# EAGLE schematic beacon3v04 (EAGLE 6.1)
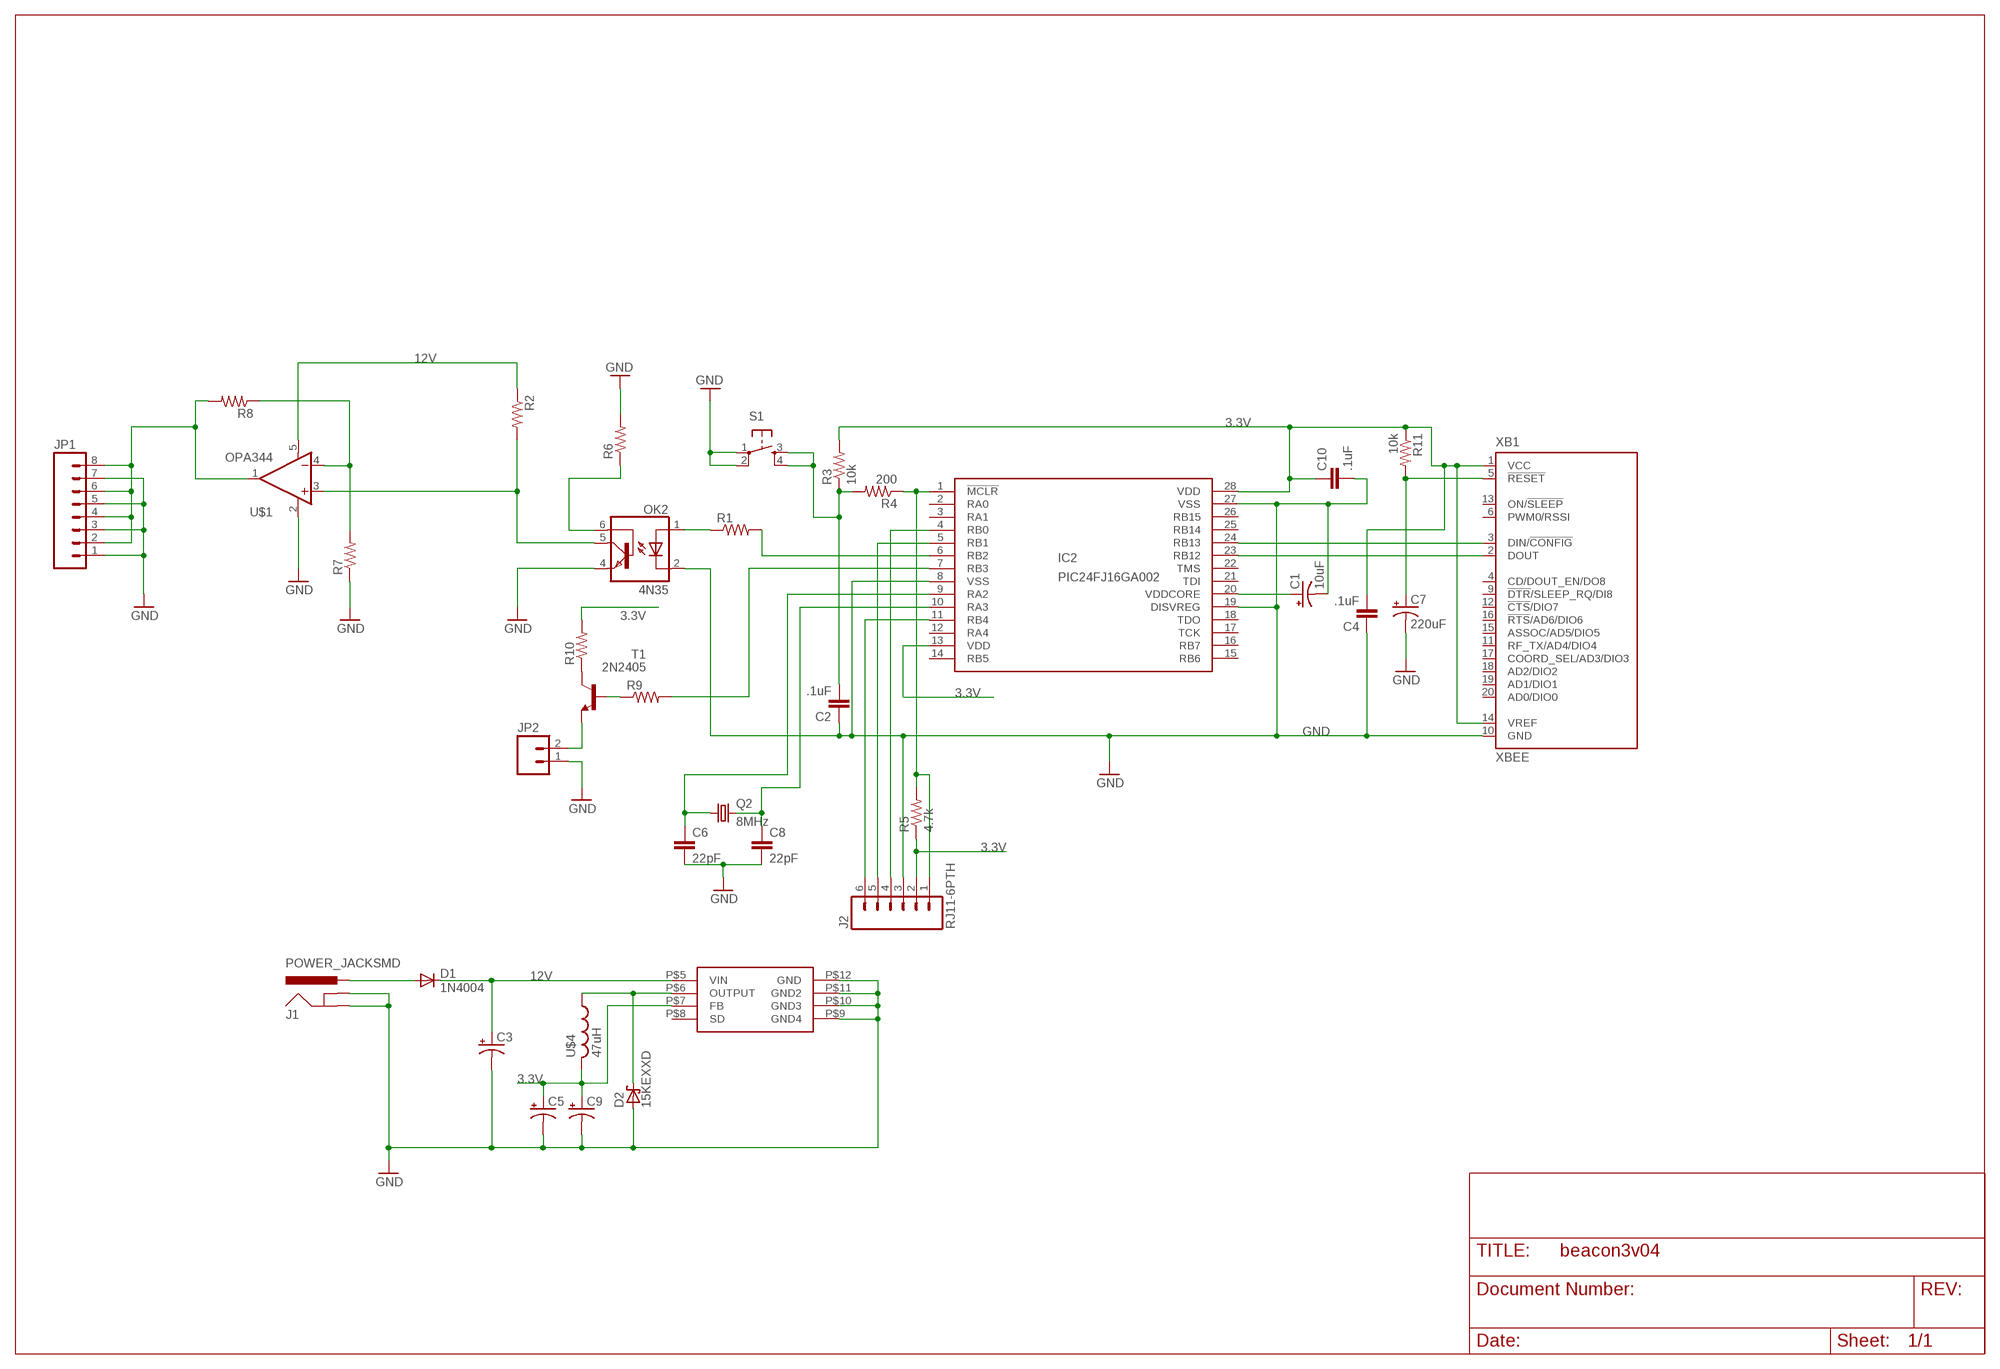
[diagram p0: schematic, sheet 1]

## Parts
C1  10uF  CAP_POL1206  [EIA3216]
C2  .1uF  C-EUC1206  [C1206]
C3  CAP_POL1206  [EIA3216]
C4  .1uF  C-EUC1206  [C1206]
C5  CAP_POL1206  [EIA3216]
C6  22pF  C-EUC1206  [C1206]
C7  220uF  CAP_POL1206  [EIA3216]
C8  22pF  C-EUC1206  [C1206]
C9  CAP_POL1206  [EIA3216]
C10  .1uF  C-EUC1206  [C1206]
D1  1N4004  [DO41-10]
D2  15KEXXD  [DO201T15]
IC2  PIC24FJ16GA002  [SO28W]
J1  POWER_JACKSMD  [POWER_JACK_SMD]
J2  RJ11-6PTH  [RJ11-6]
JP1  M08LOCK  [1X08_LOCK]
JP2  M02LOCK  [1X02_LOCK]
OK2  4N35  [DIL06]
Q2  8MHz  CRYSTALHC49UP  [HC49UP]
R1  RESISTOR1206  [1206]
R2  RESISTOR1206  [1206]
R3  10k  RESISTOR1206  [1206]
R4  200  RESISTOR1206  [1206]
R5  4.7k  R-US_R1206  [R1206]
R6  R-US_R1206  [R1206]
R7  RESISTOR1206  [1206]
R8  RESISTOR1206  [1206]
R9  R-US_R1206  [R1206]
R10  R-US_R1206  [R1206]
R11  10k  RESISTOR1206  [1206]
S1  TAC_SWITCHSMD  [TACTILE_SWITCH_SMD]
T1  2N2405  [TO5]
U$1  OPA344  [SOT23-5]
U$3  BUCK1  [BUCK]
U$4  47uH  BUCKINDUCTOR  [BUCKINDUCTOR2]
XB1  XBEE  [XBEE]

## Nets
3.3V: C4.2 C5.A(+) C9.A(+) C10.1 IC2.13(VDD) IC2.28(VDD) J2.2 R3.2 R5.1 R10.2 R11.1 U$3.P$7(FB) U$4.P$2 XB1.1(VCC) XB1.14(VREF)
12V: C3.A(+) D1.C R2.1 U$1.5(V+) U$3.P$5(VIN)
GND: C1.C(-) C2.1 C3.C(-) C4.1 C5.C(-) C6.2 C7.C(-) C8.2 C9.C(-) C10.2 D2.A IC2.8(VSS) IC2.19(DISVREG) IC2.27(VSS) J1.GND(GNDBREAK) J1.P$4(GND) J2.3 JP1.1 JP1.3 JP1.5 JP1.7 JP2.1 OK2.2(C) OK2.4(EMI) R6.2 R7.1 S1.1 S1.2 U$1.2(V-) U$3.P$9(GND4) U$3.P$10(GND3) U$3.P$11(GND2) U$3.P$12(GND) XB1.10(GND)
N$1: IC2.6(RB2) R1.2
N$2: OK2.1(A) R1.1
N$3: R7.2 R8.1 U$1.4(-IN)
N$4: D1.A J1.VIN0(PWR)
N$5: OK2.6(BAS) R6.1
N$6: IC2.23(RB12) XB1.2(DOUT)
N$7: JP1.2 JP1.4 JP1.6 JP1.8 R8.2 U$1.1(OUT)
N$8: IC2.24(RB13) XB1.3(DIN/!CONFIG)
N$9: IC2.4(RB0) J2.4
N$10: C1.A(+) IC2.20(VDDCORE)
N$11: C2.2 R3.1 R4.2 S1.3 S1.4
N$12: IC2.1(!MCLR) J2.1 R4.1 R5.2
N$13: C7.A(+) R11.2 XB1.5(!RESET)
N$14: D2.C U$3.P$6(OUTPUT) U$4.P$1
N$15: OK2.5(COL) R2.2 U$1.3(+IN)
N$16: IC2.7(RB3) R9.2
N$18: JP2.2 T1.1(E)
N$19: IC2.5(RB1) J2.5
N$20: IC2.11(RB4) J2.6
N$21: R10.1 T1.3(C)
N$22: C6.1 IC2.9(RA2) Q2.1
N$24: C8.1 IC2.10(RA3) Q2.2
N$25: R9.1 T1.2(B)
Unconnected: IC2.2(RA0) IC2.3(RA1) IC2.12(RA4) IC2.14(RB5) IC2.15(RB6) IC2.16(RB7) IC2.17(TCK) IC2.18(TDO) IC2.21(TDI) IC2.22(TMS) IC2.25(RB14) IC2.26(RB15) U$3.P$8(SD) XB1.4(CD/DOUT_EN/DO8) XB1.6(PWM0/RSSI) XB1.9(!DTR!/SLEEP_RQ/DI8) XB1.11(RF_TX/AD4/DIO4) XB1.12(!CTS!/DIO7) XB1.13(ON/!SLEEP) XB1.15(ASSOC/AD5/DIO5) XB1.16(!RTS!/AD6/DIO6) XB1.17(COORD_SEL/AD3/DIO3) XB1.18(AD2/DIO2) XB1.19(AD1/DIO1) XB1.20(AD0/DIO0)

## Library data of the parts
C1 C3 C5 C7 C9 = SparkFun-Passives:CAP_POL: Capacitor Polarized These are standard SMD and PTH capacitors. Normally 10uF, 47uF, and 100uF in electrolytic and tantalum varieties. Always verify the external diameter of the through hole cap, it varies with capacity, voltage, and manufacturer. The EIA devices should be standard.
C2 C4 C6 C8 C10 = resistor:C-EU: CAPACITOR, European symbol
D1 = diode:1N4004: DIODE general purpose rectifier, 1 A
D2 = diode:15KEXXD: DIODE
IC2 = beacon:PIC24FJ16GA002: PIC24FJ16GA002 edit this description Auto generated by make-symbol-device-package-bsdl.ulp Rev. 25 Source: PIC24FJ16GA002.bsd
J1 = SparkFun-Connectors:POWER_JACK: Power Jack This is the standard 5.5mm barrel jack for power. The PTH is the most common, proven, reliable, footprint. All others are experimental. The Slot footprint only works if the mill layer is transmitted to the PCB fab house so be warned. Spark Fun Electronics SKU : PRT-00119. Mating wall wart : TOL-00298 (and others)
J2 = SparkFun-Connectors:RJ11-6: RJ11 Jack Simple 6 pin RJ11 jack. Commonly found on CAT3 devices and Microchip programmers. SKU: PRT-00132
JP1 = SparkFun-Connectors:M08: Header 8 Standard 8-pin 0.1" header. Use with straight break away headers (SKU : PRT-00116), right angle break away headers (PRT-00553), swiss pins (PRT-00743), machine pins (PRT-00117), and female headers (PRT-00115).
JP2 = SparkFun-Connectors:M02: Header 2 Standard 2-pin 0.1" header. Use with straight break away headers (SKU : PRT-00116), right angle break away headers (PRT-00553), swiss pins (PRT-00743), machine pins (PRT-00117), and female headers (PRT-00115). Molex polarized connector foot print use with SKU : PRT-08233 with associated crimp pins and housings.
OK2 = optocoupler:4N35: MOTOROLA OPTO COUPLER; MF: FAIRCHILD SEMICONDUCTOR; MPN: 4N35; OC_FARNELL: 1328375; OC_NEWARK: 72K9946
Q2 = crystal:CRYSTAL: CRYSTAL; OC_FARNELL: unknown; OC_NEWARK: unknown
R1-R4 R7 R8 R11 = SparkFun-Passives:RESISTOR: Resistor Basic schematic elements and footprints for 0603, 1206, and PTH resistors.
R5 R6 R9 R10 = rcl:R-US_: RESISTOR, American symbol
S1 = SparkFun-Electromechanical:TAC_SWITCH: Momentary Switch Button commonly used for reset or general input. Spark Fun Electronics SKU : COM-00097
T1 = transistor:2N2405: NPN TRANSISTOR
U$1 = SparkFun-AnalogIC:OPA344: Single gate rail-to-rail output op-amp. Inputs extend 300mV past rails.
U$3 = beacon:BUCK1
U$4 = beacon:BUCKINDUCTOR
XB1 = maxstream:XBEE: XBee (TM) /XBee-PRO(TM) OEM RF Modules Source: MaxStream, Inc. xbee_productmanual.pdf; MPN: XBP24-Z7UIT-004; OC_FARNELL: 1751799; OC_NEWARK: 34R5507